# EAGLE schematic boardv2FNR (EAGLE 6.6.0)
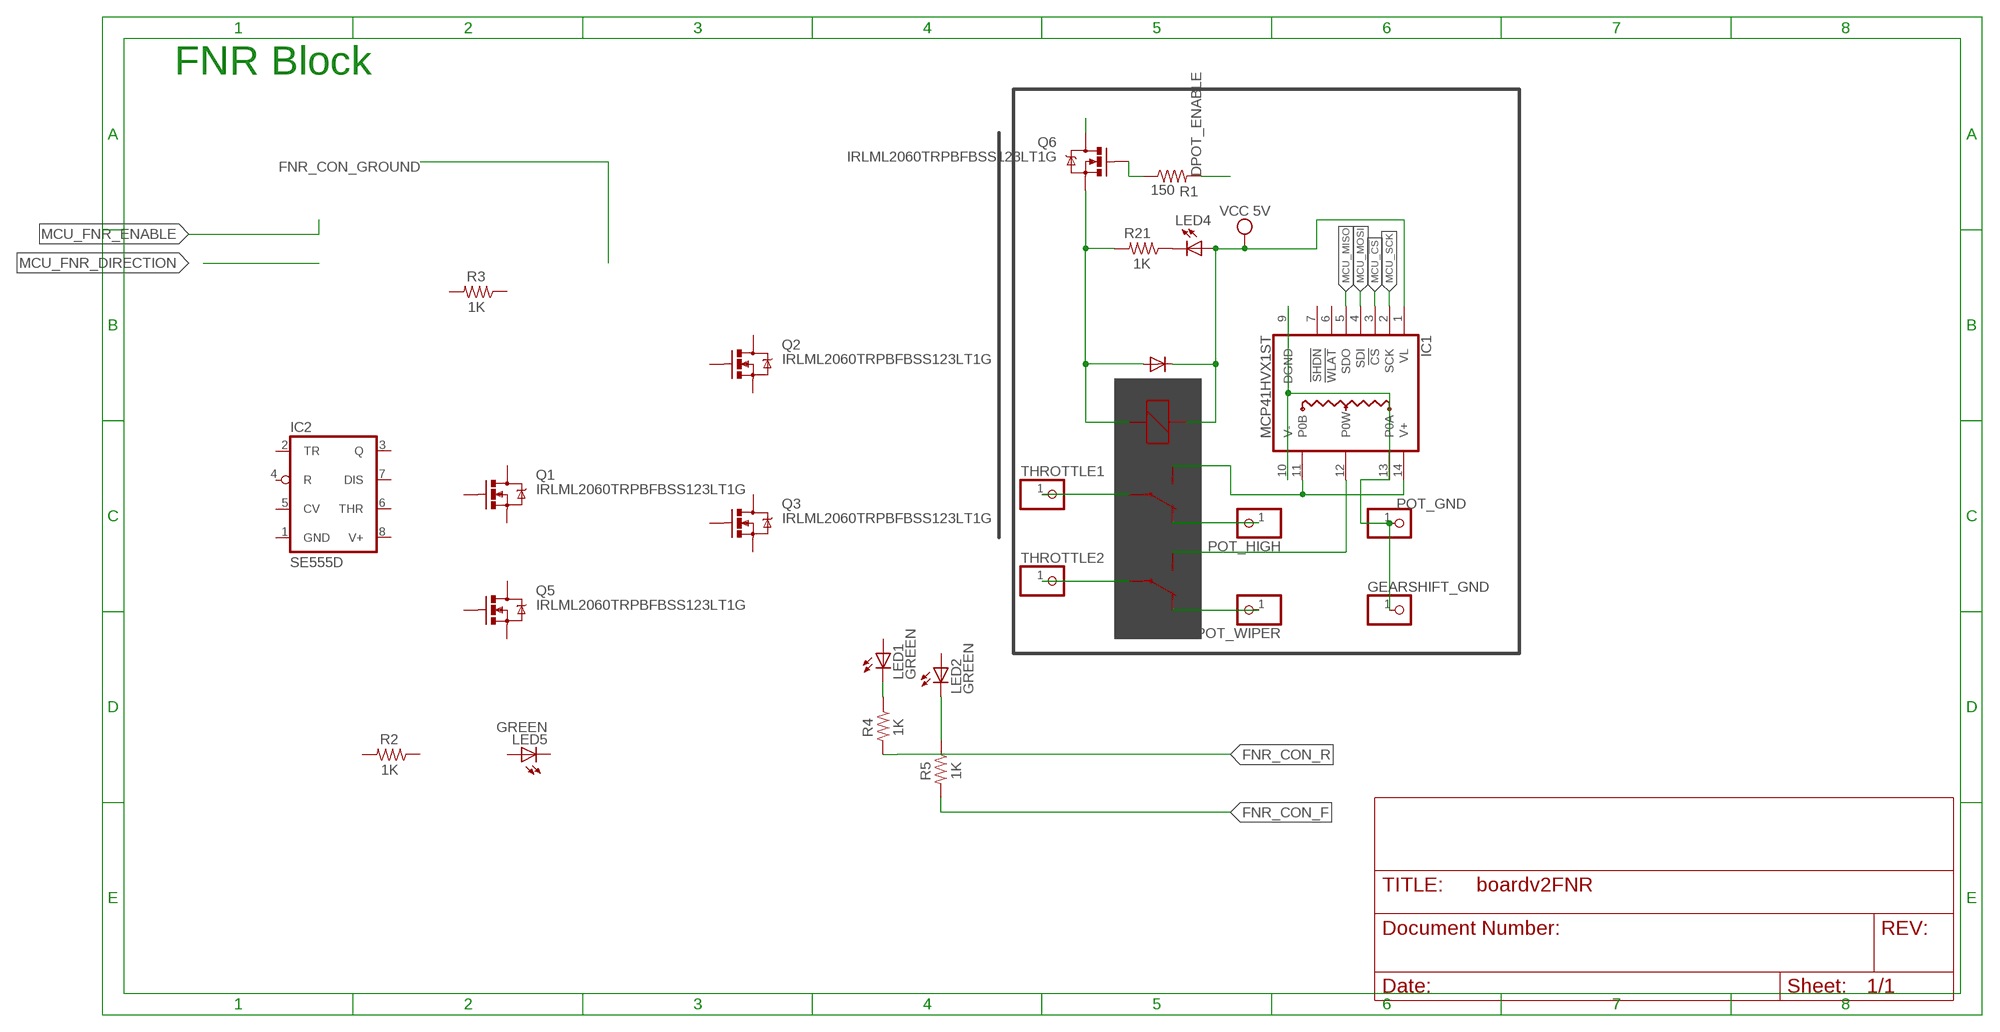
[diagram p0: schematic, sheet 1]

## Parts
D5  1N4004  [DO41-10]
GEARSHIFT_GND  PINHD-1X1  [1X01]
IC1  MCP41HVX1ST  [TSSOP14]
IC2  SE555D  [SO08]
K1  G5V-2  [G5V-2]
LED1  GREEN  LED3MM  [LED3MM]
LED2  GREEN  LED3MM  [LED3MM]
LED4  LED3MM  [LED3MM]
LED5  GREEN  LED3MM  [LED3MM]
POT_GND  POT_GND  PINHD-1X1  [1X01]
POT_HIGH  PINHD-1X1  [1X01]
POT_WIPER  PINHD-1X1  [1X01]
Q1  IRLML2060TRPBFBSS123LT1G  [SOT23-3]
Q2  IRLML2060TRPBFBSS123LT1G  [SOT23-3]
Q3  IRLML2060TRPBFBSS123LT1G  [SOT23-3]
Q5  IRLML2060TRPBFBSS123LT1G  [SOT23-3]
Q6  IRLML2060TRPBFBSS123LT1G  [SOT23-3]
R1  150  R-US_0204/5  [0204/5]
R2  1K  R-US_0204/5  [0204/5]
R3  1K  R-US_0204/5  [0204/5]
R4  1K  R-US_0204/5  [0204/5]
R5  1K  R-US_0204/5  [0204/5]
R21  1K  R-US_0204/5  [0204/5]
THROTTLE1  PINHD-1X1  [1X01]
THROTTLE2  PINHD-1X1  [1X01]

## Nets
+5V: D5.C IC1.1(VL) K1.1 LED4.A ; supply symbol labelled VCC 5V
DPOT_ENABLE: R1.2
FNR_CON_F: R5.2
FNR_CON_R: R4.2
GND: GEARSHIFT_GND.1 IC1.9(DGND) IC1.10(V-) IC1.13(P0A) POT_GND.1
MCU_!CS: IC1.3(!CS)
MCU_MISO: IC1.5(SDO)
MCU_MOSI: IC1.4(SDI)
MCU_SCK: IC1.2(SCK)
N$1: Q6.3(D)
N$2: Q6.1(G) R1.1
N$3: LED1.K(C) R4.1
N$4: LED2.K(C) R5.1
N$17: LED4.K(C) R21.1
N$51: IC1.11(P0B) IC1.14(V+) K1.9(2:S)
N$52: IC1.12(P0W) K1.8(1:S)
N$57: D5.A K1.16 Q6.2(S) R21.2
POT_HIGH: K1.11(2:O) POT_HIGH.1
POT_WIPER: K1.6(1:O) POT_WIPER.1
THROTTLE1: K1.13(2:P) THROTTLE1.1
THROTTLE2: K1.4(1:P) THROTTLE2.1
Unconnected: IC1.6(!WLAT) IC1.7(!SHDN) IC2.2(TR) IC2.3(Q) IC2.4(R) IC2.5(CV) IC2.6(THR) IC2.7(DIS) LED1.A LED2.A LED5.A LED5.K(C) Q1.1(G) Q1.2(S) Q1.3(D) Q2.1(G) Q2.2(S) Q2.3(D) Q3.1(G) Q3.2(S) Q3.3(D) Q5.1(G) Q5.2(S) Q5.3(D) R2.1 R2.2 R3.1 R3.2

## Notes on the sheet
- FNR Block

## Power pins joined to a net without a drawn wire
GND: IC2.1(GND)
V+: IC2.8(V+)

## Library data of the parts
D5 = adafruit:1N4004: DIODE General purpose 1N400x type rectifier (With bigger pads) http://www.ladyada.net/library/pcb/eaglelibrary.html
GEARSHIFT_GND POT_GND POT_HIGH POT_WIPER THROTTLE1 THROTTLE2 = adafruit:PINHD-1X1: Pin header 1x1 for 0.1" spacing With round pins
IC1 = microchip-mcp41hvx1:MCP41HVX1: The MCP45HVX1 family of devices have dual power rails (analog and digital). The analog power rail allows high voltage on the resistor network terminal pins. The analog voltage range is determined by the V+ and V– voltages. The library has been designed by Richard Magdycz <https://www.facebook.com/groups/eaglecadsoftUK>
IC2 = linear:*555: TIMER
K1 = relay:G5V-2: OMRON PCB Relay Source: http://www.omron.com/ecb/products/pdf/en-g5v2.pdf; MPN: G5V-2 5DC; OC_FARNELL: 9949488; OC_NEWARK: 78K5703
LED1 LED2 LED4 LED5 = adafruit:LED: LED OSRAM: - CHIPLED LG R971, LG N971, LY N971, LG Q971, LY Q971, LO R971, LY R971 LH N974, LH R974 LS Q976, LO Q976, LY Q976 LO Q996 - Hyper CHIPLED LW Q18S LB Q993, LB Q99A, LB R99A - SideLED LS A670, LO A670, LY A670, LG A670, LP A670 LB A673, LV A673, LT A673, LW A673 LH A674 LY A675 LS A676, LA A676, LO A676, LY A676, LW A676 LS A679, LY A679, LG A679 - Hyper Micro SIDELED® LS Y876, LA Y876, LO Y876, LY Y876 LT Y87S - SmartLED LW L88C, LW L88S LB L89C, LB L89S, LG L890 LS L89K, LO L89K, LY L89K LS L896, LA L896, LO L896, LY L896 - TOPLED LS T670, LO T670, LY T670, LG T670, LP T670 LSG T670, LSP T670, LSY T670, LOP T670, LYG T670 LG T671, LOG T671, LSG T671 LB T673, LV T673, LT T673, LW T673 LH T674 LS T676, LA T676, LO T676, LY T676, LB T676, LH T676, LSB T676, LW T676 LB T67C, LV T67C, LT T67C, LS T67K, LO T67K, LY T67K, LW E67C LS E67B, LA E67B, LO E67B, LY E67B, LB E67C, LV E67C, LT E67C LW T67C LS T679, LY T679, LG T679 LS T770, LO T770, LY T770, LG T770, LP T770 LB T773, LV T773, LT T773, LW T773 LH T774 LS E675, LA E675, LY E675, LS T675 LS T776, LA T776, LO T776, LY T776, LB T776 LHGB T686 LT T68C, LB T68C - Hyper Mini TOPLED® LB M676 - Mini TOPLED Santana® LG M470 LS M47K, LO M47K, LY M47K Source: http://www.osram.convergy.de/
Q1-Q3 Q5 Q6 = SparkFun-DiscreteSemi:IRLML2060TRPBF: Common NMOSFET Parts MFG P/N Store ID Prod ID FDD8780 TRANS-09984 SI7820DN TRANS-11055 FDS6630A IC-08089 2N7002PW TRANS-11151 FQP30N06L COM-10213 TRANS-10060 BSS123LT1G TRANS-08345 BSS138 TRANS-00830 BS170 2N7000; PROD_ID: TRANS-08345
R1-R5 R21 = rcl:R-US_: RESISTOR, American symbol

## Net classes
0 default: width 0.203 mm, drill 0.406 mm, clearance 0.102 mm